# EAGLE design QSOP28 breakout (EAGLE 5.06)
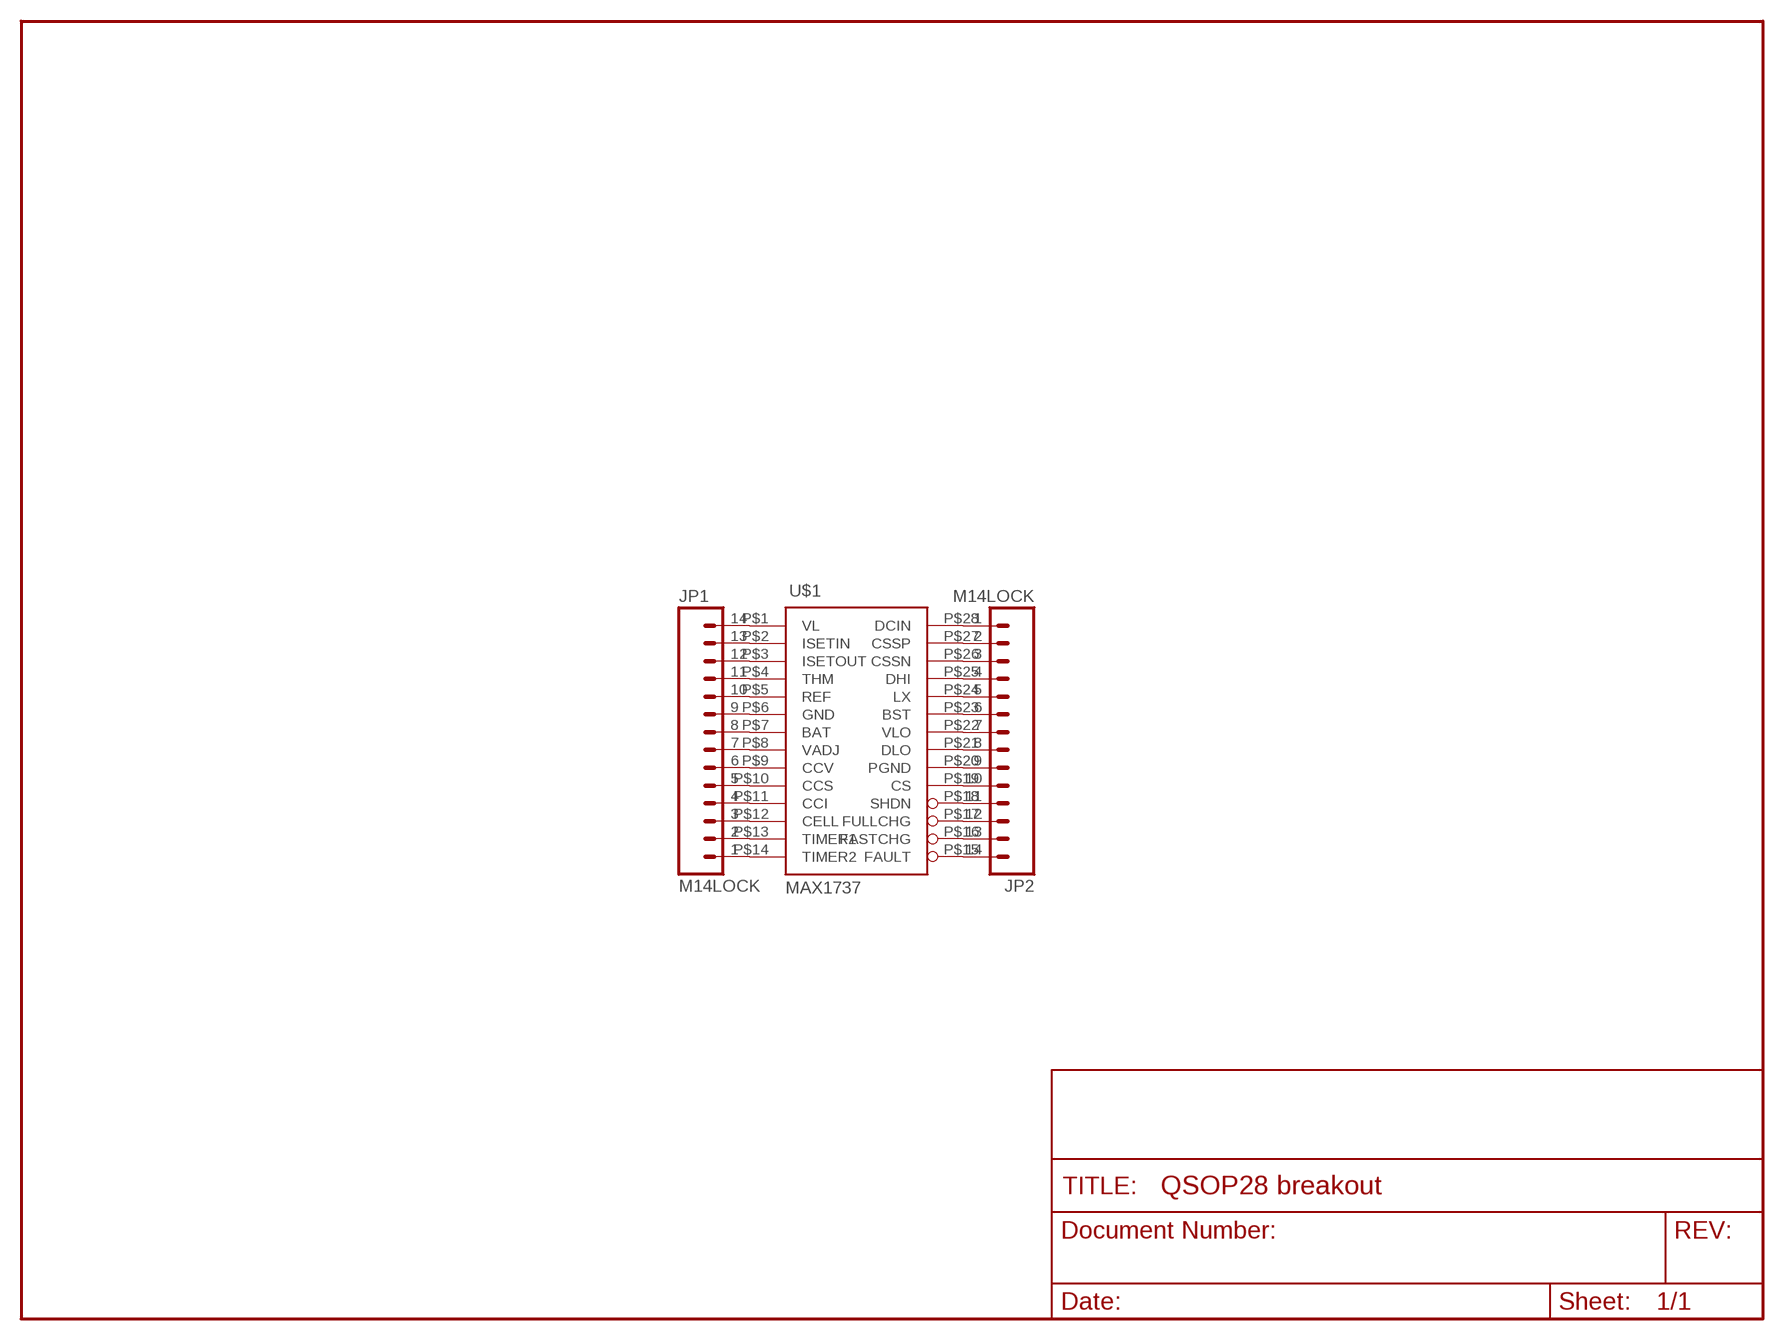
[diagram p0: schematic, sheet 1]

## Parts
JP1  M14LOCK  [1X14_LOCK]
JP2  M14LOCK  [1X14_LOCK]
U$1  MAX1737  [QSOP28]

## Nets
N$1: JP1.14 U$1.P$1(VL)
N$2: JP1.13 U$1.P$2(ISETIN)
N$3: JP1.12 U$1.P$3(ISETOUT)
N$4: JP1.11 U$1.P$4(THM)
N$5: JP1.10 U$1.P$5(REF)
N$6: JP1.9 U$1.P$6(GND)
N$7: JP1.8 U$1.P$7(BAT)
N$8: JP1.7 U$1.P$8(VADJ)
N$9: JP1.6 U$1.P$9(CCV)
N$10: JP1.5 U$1.P$10(CCS)
N$11: JP1.4 U$1.P$11(CCI)
N$12: JP1.3 U$1.P$12(CELL)
N$13: JP1.2 U$1.P$13(TIMER1)
N$14: JP1.1 U$1.P$14(TIMER2)
N$15: JP2.14 U$1.P$15(FAULT)
N$16: JP2.13 U$1.P$16(FASTCHG)
N$17: JP2.12 U$1.P$17(FULLCHG)
N$18: JP2.11 U$1.P$18(SHDN)
N$19: JP2.10 U$1.P$19(CS)
N$20: JP2.9 U$1.P$20(PGND)
N$21: JP2.8 U$1.P$21(DLO)
N$22: JP2.7 U$1.P$22(VLO)
N$23: JP2.6 U$1.P$23(BST)
N$24: JP2.5 U$1.P$24(LX)
N$25: JP2.4 U$1.P$25(DHI)
N$26: JP2.3 U$1.P$26(CSSN)
N$27: JP2.2 U$1.P$27(CSSP)
N$28: JP2.1 U$1.P$28(DCIN)

## Library data of the parts
JP1 JP2 = SparkFun:M14: Header 14 Standard 14-pin 0.1" header. Use with straight break away headers (SKU : PRT-00116), right angle break away headers (PRT-00553), swiss pins (PRT-00743), machine pins (PRT-00117), and female headers (PRT-00115).
U$1 = brokenlcd:MAX1737

## Board
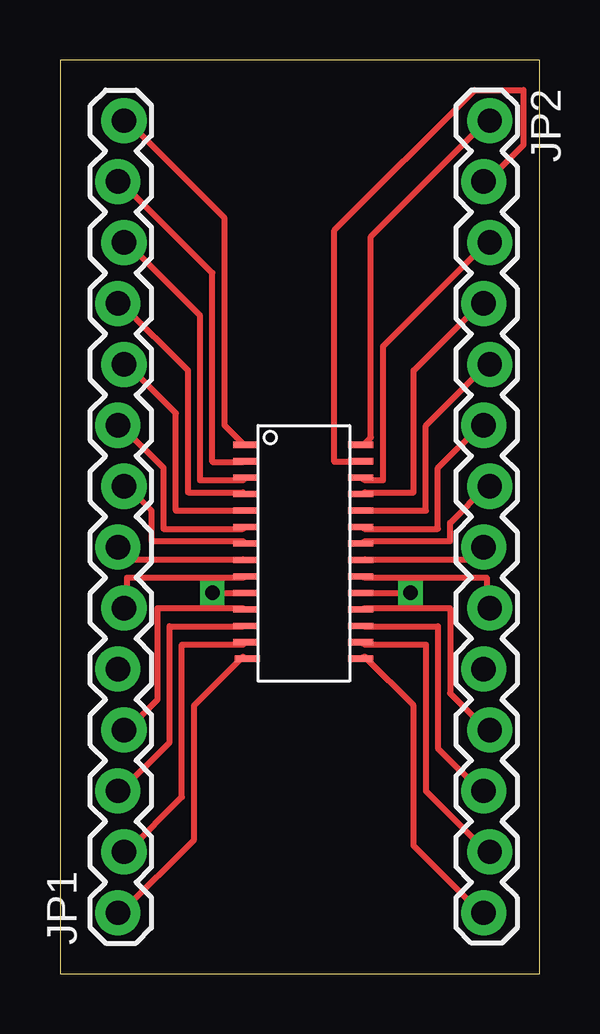
[diagram p1: board, top side]
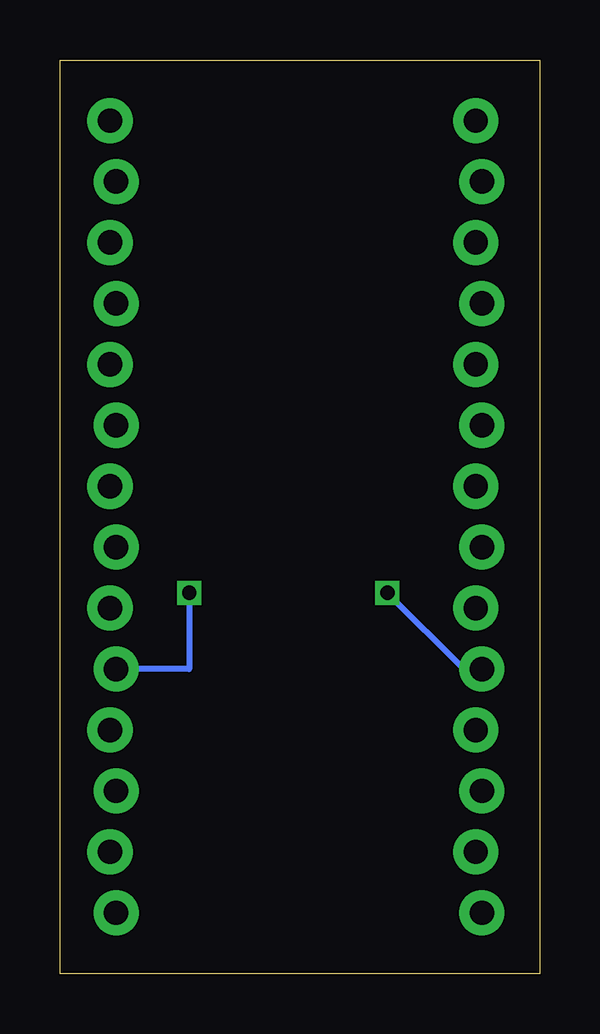
[diagram p2: board, bottom side, seen from below]

Size 19.99 x 38.09 mm. Coordinates in mm from the lower left corner, seen from the top.
Outline: 0,0 19.99,0 19.99,38.09 0,38.09 0,0
Copper layers (1*16): Top 0.035mm / dielectric 1.5mm / Bottom 0.035mm
Design rules "default": minimum track width 10mil, minimum drill 24mil, track to track 8mil, track to pad 8mil, pad to pad 8mil, via to via 8mil, smd to smd 8mil, copper to edge 40mil, drill to drill 8mil, minimum pad ring 10mil, minimum via ring 8mil, stop-mask expansion 4mil, vias tented up to drill 0mil, thermal gap 10mil

### Footprints (pad centres in the part's own frame; a part is rotated, then mirrored left to right if it is on the bottom)
1X14_LOCK = drill 1.016 pad 1.88 round: 1 0,0.127; 2 2.54,-0.127; 3 5.08,0.127; 4 7.62,-0.127; 5 10.16,0.127; 6 12.7,-0.127; 7 15.24,0.127; 8 17.78,-0.127; 9 20.32,0.127; 10 22.86,-0.127; 11 25.4,0.127; 12 27.94,-0.127; 13 30.48,0.127; 14 33.02,-0.127
QSOP28 = smd 0.254 x 1.041: P$1 0.813,-0.508; P$2 1.499,-0.508; P$3 2.184,-0.508; P$4 2.87,-0.508; P$5 3.556,-0.508; P$6 4.242,-0.508; P$7 4.928,-0.508; P$8 5.613,-0.508; P$9 6.299,-0.508; P$10 6.985,-0.508; P$11 7.671,-0.508; P$12 8.357,-0.508; P$13 9.042,-0.508; P$14 9.728,-0.457; P$15 9.728,4.267; P$16 9.042,4.267; P$17 8.357,4.267; P$18 7.671,4.267; P$19 6.985,4.267; P$20 6.299,4.267; P$21 5.613,4.267; P$22 4.928,4.267; P$23 4.242,4.267; P$24 3.556,4.267; P$25 2.87,4.267; P$26 2.184,4.267; P$27 1.499,4.267; P$28 0.813,4.267

### Placement (x,y rotation side)
JP1  2.54,2.54 90 top
JP2  17.78,35.56 270 top
U$1  8.26,22.86 270 top

### Tracks (layer width: path | path; a pad name or v marks a point on that pad's centre or on a via)
N$1
  Top 0.254: U$1.P$1 7.62,22.1 6.86,22.86 6.86,31.5 2.79,35.56 JP1.14
N$2
  Top 0.254: U$1.P$2 7.62,21.34 6.35,21.34 6.35,29.21 2.54,33.02 JP1.13
N$3
  Top 0.254: U$1.P$3 7.62,20.57 5.84,20.57 5.84,27.43 2.79,30.48 JP1.12
N$4
  Top 0.254: U$1.P$4 7.62,20.07 5.33,20.07 5.33,25.15 2.54,27.94 JP1.11
N$5
  Top 0.254: U$1.P$5 4.83,19.3 4.83,23.37 2.79,25.4 JP1.10
N$6
  Top 0.254: U$1.P$6 7.62,18.54 4.32,18.54 4.32,21.08 2.54,22.86 JP1.9
N$7
  Top 0.254: U$1.P$7 7.62,18.03 3.81,18.03 3.81,19.3 2.79,20.32 JP1.8
N$8
  Top 0.254: U$1.P$8 7.62,17.27 2.54,17.27 2.54,17.78 JP1.7
N$9
  Top 0.254: U$1.P$9 7.62,16.51 2.79,16.51 2.79,15.24 JP1.6
N$10  (via drill 0.6)
  Top 0.254: v6.35,15.88 U$1.P$10
  Bottom 0.254: JP1.5 3.17,12.7 v6.35,15.88
N$11
  Top 0.254: U$1.P$11 7.62,15.24 4.06,15.24 4.06,11.43 2.79,10.16 JP1.4
N$12
  Top 0.254: U$1.P$12 7.62,14.48 4.57,14.48 4.57,9.65 2.54,7.62 JP1.3
N$13
  Top 0.254: U$1.P$13 7.62,13.72 5.08,13.72 5.08,7.37 2.79,5.08 JP1.2
N$14
  Top 0.254: U$1.P$14 7.62,13.21 5.59,11.18 5.59,5.59 2.54,2.54 JP1.1
N$15
  Top 0.254: U$1.P$15 12.7,13.21 14.73,11.18 14.73,5.33 17.53,2.54 JP2.14
N$16
  Top 0.254: U$1.P$16 12.7,13.72 15.24,13.72 15.24,7.62 17.78,5.08 JP2.13
N$17
  Top 0.254: U$1.P$17 12.7,14.48 15.75,14.48 15.75,9.4 17.53,7.62 JP2.12
N$18
  Top 0.254: U$1.P$18 12.7,15.24 16.26,15.24 16.26,11.68 17.78,10.16 JP2.11
N$19  (via drill 0.6)
  Top 0.254: U$1.P$19 v14.61,15.88
  Bottom 0.254: v14.61,15.88 14.61,12.7 JP2.10
N$20
  Top 0.254: U$1.P$20 12.7,16.51 17.78,16.51 17.78,15.24 JP2.9
N$21
  Top 0.254: U$1.P$21 12.7,17.27 17.53,17.27 17.53,17.78 JP2.8
N$22
  Top 0.254: U$1.P$22 12.7,18.03 16.26,18.03 16.26,18.8 17.78,20.32 JP2.7
N$23
  Top 0.254: U$1.P$23 12.7,18.54 15.75,18.54 15.75,21.08 17.53,22.86 JP2.6
N$24
  Top 0.254: U$1.P$24 15.24,19.3 15.24,22.86 17.78,25.4 JP2.5
N$25
  Top 0.254: U$1.P$25 12.7,20.07 14.73,20.07 14.73,25.15 17.53,27.94 JP2.4
N$26
  Top 0.254: U$1.P$26 12.7,20.57 13.46,20.57 13.46,26.16 17.78,30.48 JP2.3
N$27
  Top 0.254: U$1.P$27 12.45,21.34 11.43,21.34 11.43,30.99 17.27,36.83 19.3,36.83 19.3,34.54 17.78,33.02 JP2.2
N$28
  Top 0.254: U$1.P$28 12.7,22.1 12.95,22.35 12.95,30.73 17.78,35.56 JP2.1